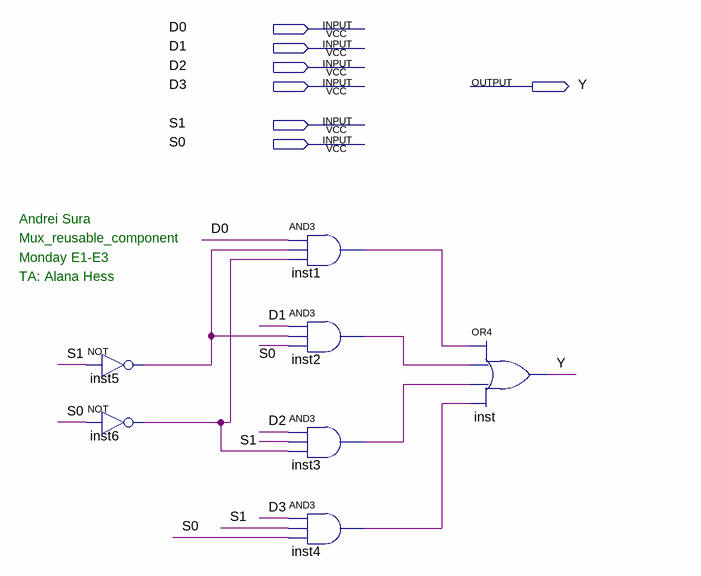
[diagram p0: schematic sheet]
// Quartus schematic mux_asura.bdf as structural Verilog: 7 symbols, 7 pins
module mux_asura (
  input  D0,
  input  D1,
  input  D2,
  input  D3,
  input  S1,
  input  S0,
  output Y
);

  wire inst1_out, inst2_out, inst3_out, inst4_out, inst5_out, inst6_out;

  not inst5 (inst5_out, S1);
  not inst6 (inst6_out, S0);
  and inst1 (inst1_out, D0, inst5_out, inst6_out);
  and inst2 (inst2_out, D1, inst5_out, S0);
  and inst3 (inst3_out, D2, S1, inst6_out);
  and inst4 (inst4_out, D3, S1, S0);
  or inst (Y, inst1_out, inst2_out, inst3_out, inst4_out);

  // Notes on the sheet:
  //   Andrei Sura
  //   Mux_reusable_component
  //   Monday E1-E3
  //   TA: Alana Hess
endmodule
